# EAGLE design transmitterFinal (EAGLE 9.6.2)
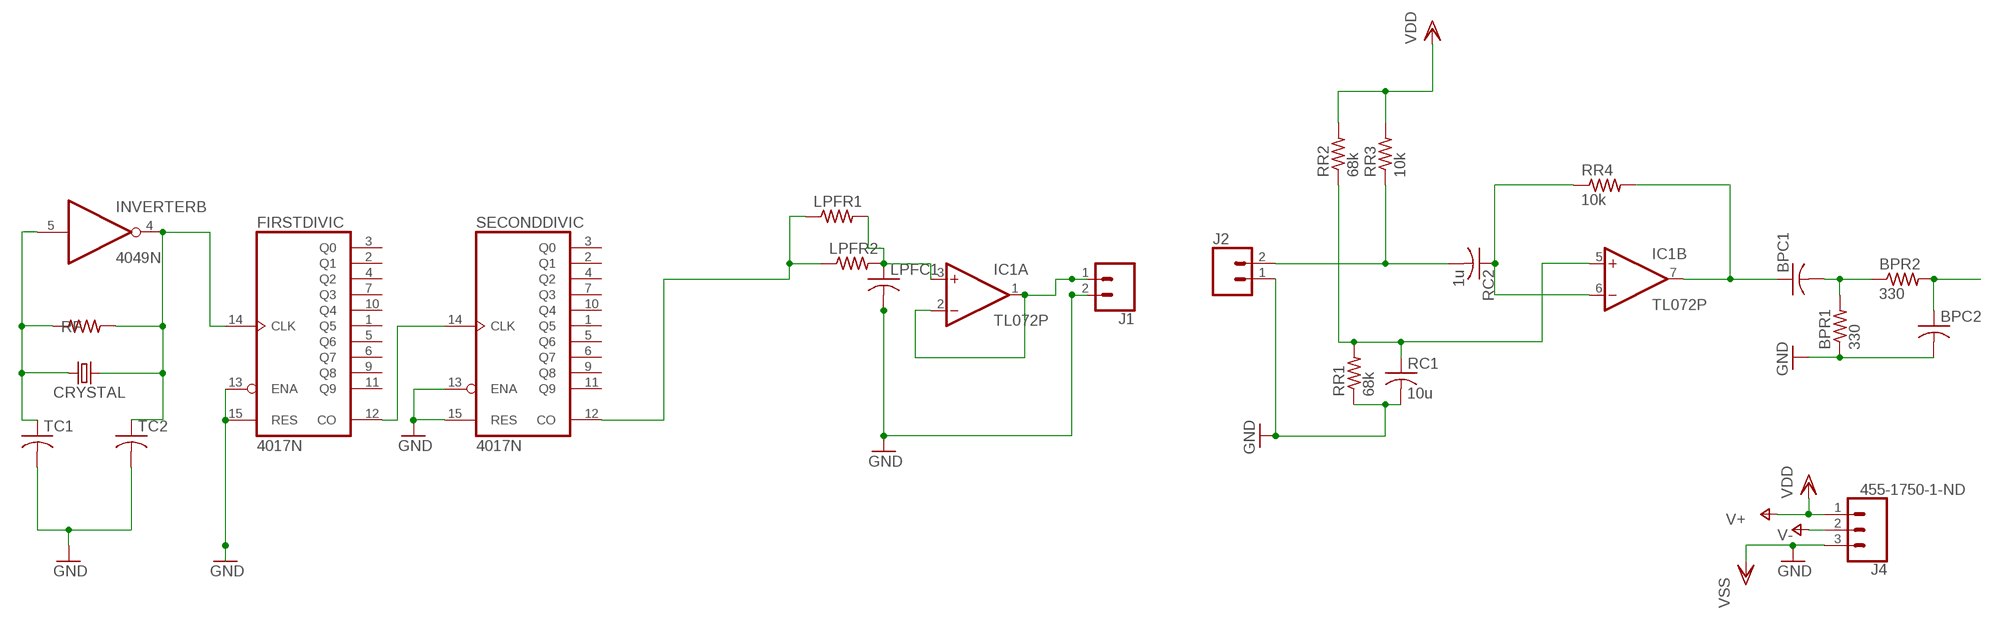
[diagram p0: schematic, sheet 1]

## Parts
BPC1  C-US050-025X075  [C050-025X075]
BPC2  C-US050-025X075  [C050-025X075]
BPR1  330  R-US_0309/12  [0309/12]
BPR2  330  R-US_0309/12  [0309/12]
CRYSTAL  CRYSTALHC49U-V  [HC49U-V]
FIRSTDIVIC  4017N  [DIL16]
IC1  TL072P  [DIL08]
INVERTER  4049N  [DIL16]
J1  CONN_02  [1X02]
J2  CONN_02  [1X02]
J4  455-1750-1-ND  CONN_03  [1X03]
LPFC1  C-US050-025X075  [C050-025X075]
LPFR1  R-US_0309/12  [0309/12]
LPFR2  R-US_0309/12  [0309/12]
RC1  10u  C-US050-025X075  [C050-025X075]
RC2  1u  C-US050-025X075  [C050-025X075]
RF  R-US_0411/15  [0411/15]
RR1  68k  R-US_0309/12  [0309/12]
RR2  68k  R-US_0309/12  [0309/12]
RR3  10k  R-US_0309/12  [0309/12]
RR4  10k  R-US_0309/12  [0309/12]
SECONDDIVIC  4017N  [DIL16]
TC1  C-US050-025X075  [C050-025X075]
TC2  C-US050-025X075  [C050-025X075]

## Nets
GND: BPC2.2 BPR1.1 FIRSTDIVIC.13(ENA) FIRSTDIVIC.15(RES) J1.2 J2.1 J4.3 LPFC1.2 RC1.2 RR1.1 SECONDDIVIC.13(ENA) SECONDDIVIC.15(RES) TC1.2 TC2.2 ; supply symbol labelled VSS
N$1: CRYSTAL.2 FIRSTDIVIC.14(CLK) INVERTER.4(B:O) RF.2 TC2.1
N$2: CRYSTAL.1 INVERTER.5(B:I) RF.1 TC1.1
N$3: FIRSTDIVIC.12(CO) SECONDDIVIC.14(CLK)
N$4: LPFR1.1 LPFR2.1 SECONDDIVIC.12(CO)
N$5: J2.2 RC2.2 RR3.1
N$6: IC1.3(A:+IN) LPFC1.1 LPFR1.2 LPFR2.2
N$7: IC1.1(A:OUT) IC1.2(A:-IN) J1.1
N$8: IC1.5(B:+IN) RC1.1 RR1.2 RR2.1
N$9: BPC1.2 BPR1.2 BPR2.1
N$10: IC1.6(B:-IN) RC2.1 RR4.1
N$11: BPC1.1 IC1.7(B:OUT) RR4.2
N$12: BPC2.1 BPR2.2
V-: J4.2
VDD: J4.1 RR2.2 RR3.2 ; supply symbol labelled V+
Unconnected: FIRSTDIVIC.1(Q5) FIRSTDIVIC.2(Q1) FIRSTDIVIC.3(Q0) FIRSTDIVIC.4(Q2) FIRSTDIVIC.5(Q6) FIRSTDIVIC.6(Q7) FIRSTDIVIC.7(Q3) FIRSTDIVIC.9(Q8) FIRSTDIVIC.10(Q4) FIRSTDIVIC.11(Q9) INVERTER.2(A:O) INVERTER.3(A:I) INVERTER.6(C:O) INVERTER.7(C:I) INVERTER.9(D:I) INVERTER.10(D:O) INVERTER.11(E:I) INVERTER.12(E:O) INVERTER.14(F:I) INVERTER.15(F:O) SECONDDIVIC.1(Q5) SECONDDIVIC.2(Q1) SECONDDIVIC.3(Q0) SECONDDIVIC.4(Q2) SECONDDIVIC.5(Q6) SECONDDIVIC.6(Q7) SECONDDIVIC.7(Q3) SECONDDIVIC.9(Q8) SECONDDIVIC.10(Q4) SECONDDIVIC.11(Q9)

## Power pins joined to a net without a drawn wire
GND: FIRSTDIVIC.8(VSS) INVERTER.8(P:VSS) SECONDDIVIC.8(VSS)
V-: IC1.4(P:V-)
VDD: FIRSTDIVIC.16(VDD) IC1.8(P:V+) INVERTER.1(P:VDD) SECONDDIVIC.16(VDD)

## Library data of the parts
BPC1 BPC2 LPFC1 RC1 RC2 TC1 TC2 = rcl:C-US: CAPACITOR, American symbol; SPICEPREFIX: C
BPR1 BPR2 LPFR1 LPFR2 RF RR1-RR4 = rcl:R-US_: RESISTOR, American symbol; SPICEPREFIX: R
CRYSTAL = crystal:CRYSTAL: CRYSTAL; OC_FARNELL: 1666969; OC_NEWARK: unknown
FIRSTDIVIC SECONDDIVIC = 40xx:4017: COUNTER/DIVIDER
IC1 = linear:TL072: OP AMP
INVERTER = 40xx:4049: Hex inverting BUFFER
J1 J2 = SparkFun-Connectors:CONN_02: Multi connection point. Often used as Generic Header-pin footprint for 0.1 inch spaced/style header connections On any of the 0.1 inch spaced packages, you can populate with these: Break Away Headers - Straight <https://www.sparkfun.com/products/116> (PRT-00116) Break Away Male Headers - Right Angle <https://www.sparkfun.com/products/553> (PRT-00553) Female Headers <https://www.sparkfun.com/products/115> (PRT-00115) Break Away Headers - Machine Pin <https://www.sparkfun.com/products/117> (PRT-00117) Break Away Female Headers - Swiss Machine Pin <https://www.sparkfun.com/products/743> (PRT-00743) For SCREWTERMINALS and SPRING TERMINALS visit here: Screw Terimnals on SparkFun.com <https://www.sparkfun.com/search/results?term=Screw+Terminals> (5mm/3.5mm/2.54mm spacing) This device is also useful as a general connection point to wire up your design to another part of your project. Our various solder wires solder well into these plated through hole pads. Hook-Up Wire - Assortment (Stranded, 22 AWG) <https://www.sparkfun.com/products/11375> (PRT-11375) Hook-Up Wire - Assortment (Solid Core, 22 AWG) <https://www.sparkfun.com/products/11367> (PRT-11367) View the entire wire category on our website here <https://www.sparkfun.com/categories/141> Special notes: Molex polarized connector foot print use with: PRT-08233 with associated crimp pins and housings. 2.54_SCREWTERM for use with PRT-10571. 3.5mm Screw Terminal footprints for PRT-08084 5mm Screw Terminal footprints for use with PRT-08432
J4 = SparkFun-Connectors:CONN_03: Multi connection point. Often used as Generic Header-pin footprint for 0.1 inch spaced/style header connections On any of the 0.1 inch spaced packages, you can populate with these: Break Away Headers - Straight <https://www.sparkfun.com/products/116> (PRT-00116) Break Away Male Headers - Right Angle <https://www.sparkfun.com/products/553> (PRT-00553) Female Headers <https://www.sparkfun.com/products/115> (PRT-00115) Break Away Headers - Machine Pin <https://www.sparkfun.com/products/117> (PRT-00117) Break Away Female Headers - Swiss Machine Pin <https://www.sparkfun.com/products/743> (PRT-00743) Stackable Header - 3 Pin (Female, 0.1") <https://www.sparkfun.com/products/13875> (PRT-13875) For SCREWTERMINALS and SPRING TERMINALS visit here: Screw Terimnals on SparkFun.com <https://www.sparkfun.com/search/results?term=Screw+Terminals> (5mm/3.5mm/2.54mm spacing) This device is also useful as a general connection point to wire up your design to another part of your project. Our various solder wires solder well into these plated through hole pads. Hook-Up Wire - Assortment (Stranded, 22 AWG) <https://www.sparkfun.com/products/11375> (PRT-11375) Hook-Up Wire - Assortment (Solid Core, 22 AWG) <https://www.sparkfun.com/products/11367> (PRT-11367) View the entire wire category on our website here <https://www.sparkfun.com/categories/141> Special notes: Molex polarized connector foot print use with SKU : PRT-08232 with associated crimp pins and housings.; PROD_ID: XXX-00000

## Board
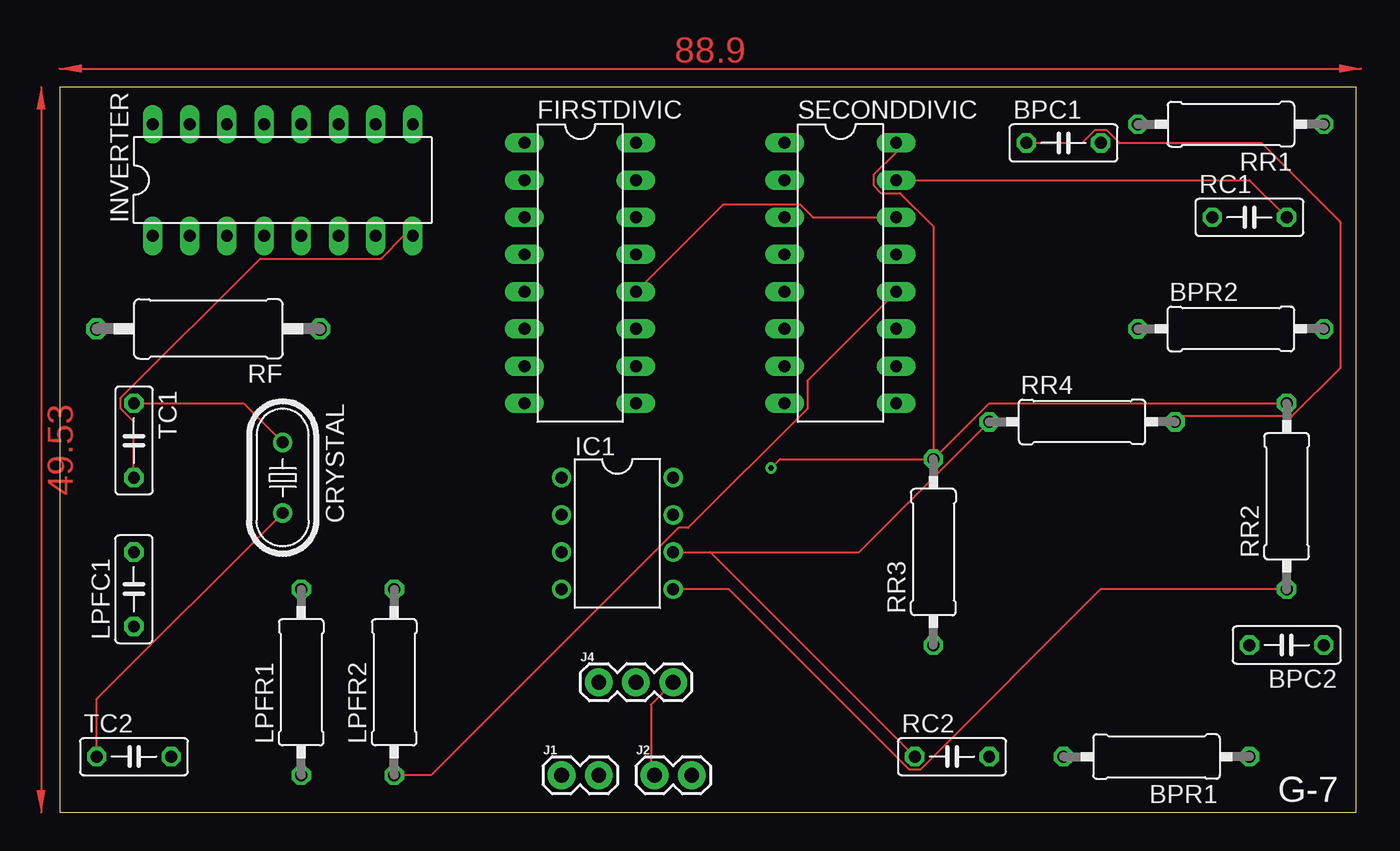
[diagram p1: board, top side]
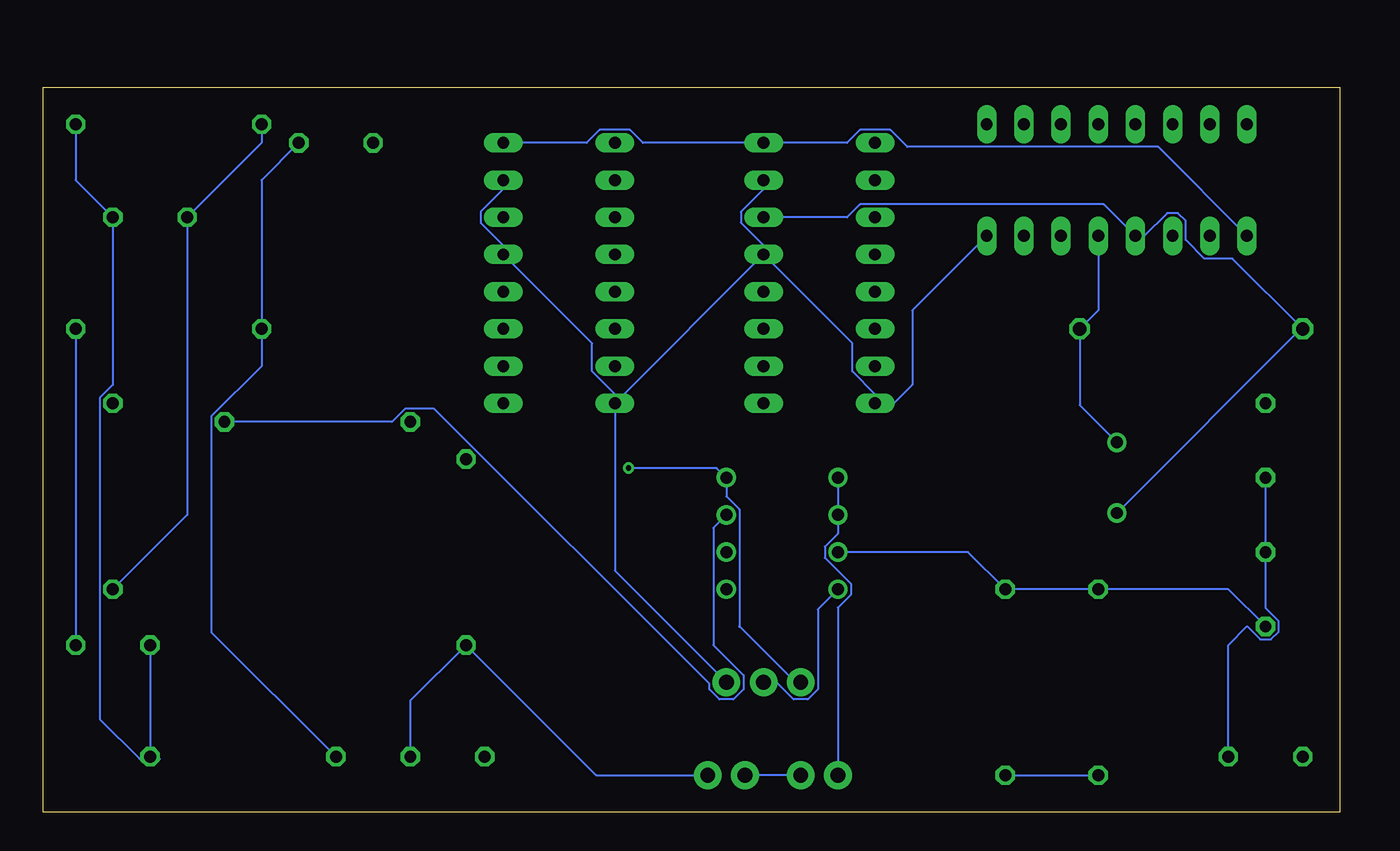
[diagram p2: board, bottom side, seen from below]

Size 88.57 x 49.52 mm. Coordinates in mm from the lower left corner, seen from the top.
Outline: 0,0 88.57,0 88.57,49.52 0,49.52 0,0
Copper layers (1*16): Top 0.035mm / dielectric 1.5mm / Bottom 0.035mm
Design rules "default": minimum track width 6mil, minimum drill 0.35mm, track to track 6mil, track to pad 6mil, pad to pad 6mil, via to via 6mil, smd to smd 6mil, copper to edge 40mil, drill to drill 6mil, minimum pad ring 10mil, minimum via ring 8mil, stop-mask expansion 4mil, vias tented up to drill 0mil, thermal gap 10mil

### Footprints (pad centres in the part's own frame; a part is rotated, then mirrored left to right if it is on the bottom)
C050-025X075 = drill 0.813 octagon: 1 -2.54,0; 2 2.54,0
0309/12 = drill 0.813 octagon: 1 -6.35,0; 2 6.35,0
HC49U-V = drill 0.813: 1 -2.413,0; 2 2.413,0
DIL16 = drill 0.813 long: 1 -8.89,-3.81; 2 -6.35,-3.81; 3 -3.81,-3.81; 4 -1.27,-3.81; 5 1.27,-3.81; 6 3.81,-3.81; 7 6.35,-3.81; 8 8.89,-3.81; 9 8.89,3.81; 10 6.35,3.81; 11 3.81,3.81; 12 1.27,3.81; 13 -1.27,3.81; 14 -3.81,3.81; 15 -6.35,3.81; 16 -8.89,3.81
DIL08 = drill 0.813 pad 1.27: 1 -3.81,-3.81; 2 -1.27,-3.81; 3 1.27,-3.81; 4 3.81,-3.81; 5 3.81,3.81; 6 1.27,3.81; 7 -1.27,3.81; 8 -3.81,3.81
1X02 = drill 1.016 pad 1.88: 1 0,0; 2 2.54,0
1X03 = drill 1.016 pad 1.88: 1 0,0; 2 2.54,0; 3 5.08,0
0411/15 = drill 0.914 octagon: 1 -7.62,0; 2 7.62,0

### Placement (x,y rotation side)
BPC1  68.58,45.72 0 top
BPC2  83.82,11.43 180 top
BPR1  74.93,3.81 180 top
BPR2  80.01,33.02 0 top
CRYSTAL  15.24,22.86 270 top
FIRSTDIVIC  35.56,36.83 270 top
IC1  38.1,19.05 270 top
INVERTER  15.24,43.18 0 top
J1  34.29,2.54 0 top
J2  40.64,2.54 0 top
J4  36.83,8.89 0 top
LPFC1  5.08,15.24 90 top
LPFR1  16.51,8.89 90 top
LPFR2  22.86,8.89 90 top
RC1  81.28,40.64 0 top
RC2  60.96,3.81 0 top
RF  10.16,33.02 180 top
RR1  80.01,46.99 180 top
RR2  83.82,21.59 90 top
RR3  59.69,17.78 90 top
RR4  69.85,26.67 0 top
SECONDDIVIC  53.34,36.83 270 top
TC1  5.08,25.4 270 top
TC2  5.08,3.81 0 top

### Tracks (layer width: path | path; a pad name or v marks a point on that pad's centre or on a via)
GND
  Top 0.152: INVERTER.8 23.51,39.37 21.96,37.82 13.7,37.82 4.19,28.31 4.19,27.57 5.08,26.68 TC1.2 | SECONDDIVIC.15 81.28,43.18 RC1.2 | J4.3 40.39,7.37 40.39,2.79 J2.1
  Bottom 0.152: FIRSTDIVIC.15 39.37,42.56 40.92,41.01 40.92,40.27 39.37,38.72 FIRSTDIVIC.13 | INVERTER.8 29.21,34.29 29.21,29.21 30.48,27.94 FIRSTDIVIC.8 31.75,28.56 33.3,30.11 33.3,32.03 FIRSTDIVIC.13 | FIRSTDIVIC.13 SECONDDIVIC.8 | SECONDDIVIC.15 57.15,42.56 58.7,41.01 58.7,40.27 57.15,38.72 SECONDDIVIC.13 51.08,32.03 51.08,30.11 49.53,28.56 SECONDDIVIC.8 | SECONDDIVIC.8 49.53,16.51 J4.3 | TC2.2 7.62,11.43 6.35,12.7 6.34,12.7 5.45,11.81 4.71,11.81 4.19,12.33 4.19,13.07 5.08,13.96 LPFC1.2 TC1.2 | J1.2 J2.1 | RR1.1 86.36,43.18 RC1.2 83.82,29.2 84.71,28.31 84.71,6.37 81.99,3.66 81.43,3.66 | 81.43,3.66 BPR1.1 | BPC2.2 81.28,4.32 80.62,3.66 81.43,3.66
N$1
  Top 0.152: TC2.1 2.54,7.75 CRYSTAL.2
  Bottom 0.152: FIRSTDIVIC.14 33.67,40.64 32.78,41.53 16.13,41.53 INVERTER.4 13.35,39.37 11.8,40.92 11.06,40.92 10.54,40.4 10.54,39.1 9.26,37.82 7.34,37.82 RF.2 2.67,33.02 CRYSTAL.2
N$2
  Top 0.152: TC1.1 12.57,27.94 CRYSTAL.1
  Bottom 0.152: INVERTER.5 16.51,34.29 RF.1 17.78,27.81 CRYSTAL.1
N$3
  Top 0.152: SECONDDIVIC.14 51.45,40.64 50.56,41.53 45.34,41.53 FIRSTDIVIC.12
N$4
  Top 0.152: SECONDDIVIC.12 51.08,29.49 51.08,27.57 42.94,19.43 42.28,19.43 25.39,2.54 LPFR2.1
  Bottom 0.152: LPFR2.1 LPFR1.1
N$5
  Bottom 0.152: RC2.2 63.5,7.62 RR3.1 50.8,2.54 J2.2
N$6
  Bottom 0.152: IC1.3 25.4,17.78 LPFR2.2 LPFR1.2 7.62,15.24 LPFC1.1
N$7
  Bottom 0.152: IC1.1 IC1.2 34.29,19.04 35.18,18.15 35.18,17.39 33.4,15.61 33.4,14.87 34.29,13.98 J1.1
N$8
  Top 0.152: RR2.1 71.11,15.24 58.79,2.92 58.05,2.92 45.73,15.24 IC1.5
  Bottom 0.152: RR1.2 73.66,45.72 RC1.1 78.74,20.32 RR2.1
N$9
  Bottom 0.152: BPC1.2 73.66,43.18 BPR2.1 73.66,30.47 77.09,27.04 77.09,12.32 BPR1.2
N$10
  Top 0.152: RC2.1 44.45,17.78 IC1.6 54.61,17.78 RR4.1
N$11
  Top 0.152: BPC1.1 69.86,45.72 70.75,46.61 71.49,46.61 72.38,45.72 82.08,45.72 87.48,40.32 87.48,30.34 84.19,27.05 76.58,27.05 RR4.2
  Bottom 0.152: RR4.2 64.76,26.67 63.87,27.56 61.86,27.56 43.08,8.78 43.08,8.41 42.39,7.72 41.43,7.72 40.74,8.41 40.74,9.37 42.8,11.43 42.8,19.43 IC1.7
N$12
  Bottom 0.152: 86.4,32.98 BPR2.2 BPC2.1
V-
  Bottom 0.152: IC1.4 35.66,13.87 35.66,8.41 36.35,7.72 37.31,7.72 38.48,8.89 J4.2
VDD  (via drill 0.35)
  Top 0.152: RR3.2 59.69,40.02 57.42,42.29 56.12,42.29 55.6,42.81 55.6,43.55 57.15,45.1 SECONDDIVIC.16 | RR3.2 63.5,27.94 RR2.2 | RR3.2 59.4,24.13 59.04,24.13 49.21,24.13 v48.6,23.52
  Bottom 0.152: INVERTER.1 12.42,45.44 29.55,45.44 30.72,46.61 32.78,46.61 33.67,45.72 FIRSTDIVIC.16 47.61,45.72 48.5,46.61 50.56,46.61 51.45,45.72 SECONDDIVIC.16 | 41.02,12.72 41.02,20.69 41.91,21.58 IC1.8 42.57,23.52 v48.6,23.52 | 41.02,12.72 41.02,12.68 | 41.02,12.72 37.19,8.89 J4.1
(copper drawn outside any net)
  shapes: Top area x2

### Text on the board
tPlace: G-7